# EAGLE schematic Adapter Board (EAGLE 9.4.2)
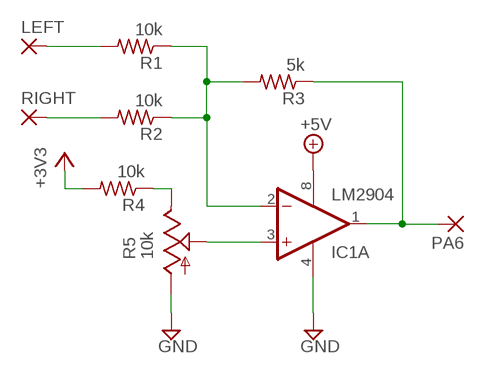
[diagram p0: schematic, sheet 1]

## Parts
IC1  LM2904  LM358N  [DIL08]
LEFT  2,54/1,0  [2,54/1,0]
PA6  2,54/1,0  [2,54/1,0]
R1  10k  R-US_0204/7  [0204/7]
R2  10k  R-US_0204/7  [0204/7]
R3  5k  R-US_0204/7  [0204/7]
R4  10k  R-US_0204/7  [0204/7]
R5  10k  TRIM_US-CA6V  [CA6V]
RIGHT  2,54/1,0  [2,54/1,0]

## Nets
+3V3: R4.2
+5V: IC1.8(P:V+)
GND: IC1.4(P:V-) R5.A
N$1: IC1.3(A:+IN) R5.S
N$2: R4.1 R5.E
N$3: IC1.2(A:-IN) R1.1 R2.1 R3.2
N$4: IC1.1(A:OUT) PA6.1(P) R3.1
N$5: R2.2 RIGHT.1(P)
N$6: LEFT.1(P) R1.2
Unconnected: IC1.5(B:+IN) IC1.6(B:-IN) IC1.7(B:OUT)

## Library data of the parts
IC1 = linear:LM358: OP AMP also LM158; LM258; LM2904 Source: http://cache.national.com/ds/LM/LM158.pdf
LEFT PA6 RIGHT = wirepad:2,54/1,0: THROUGH-HOLE PAD
R1-R4 = resistor:R-US_: RESISTOR, American symbol
R5 = pot:TRIM_US-: POTENTIOMETER